# EAGLE design REF-IN-BLE-NS 4-2 Rigid (EAGLE 7.7.0)
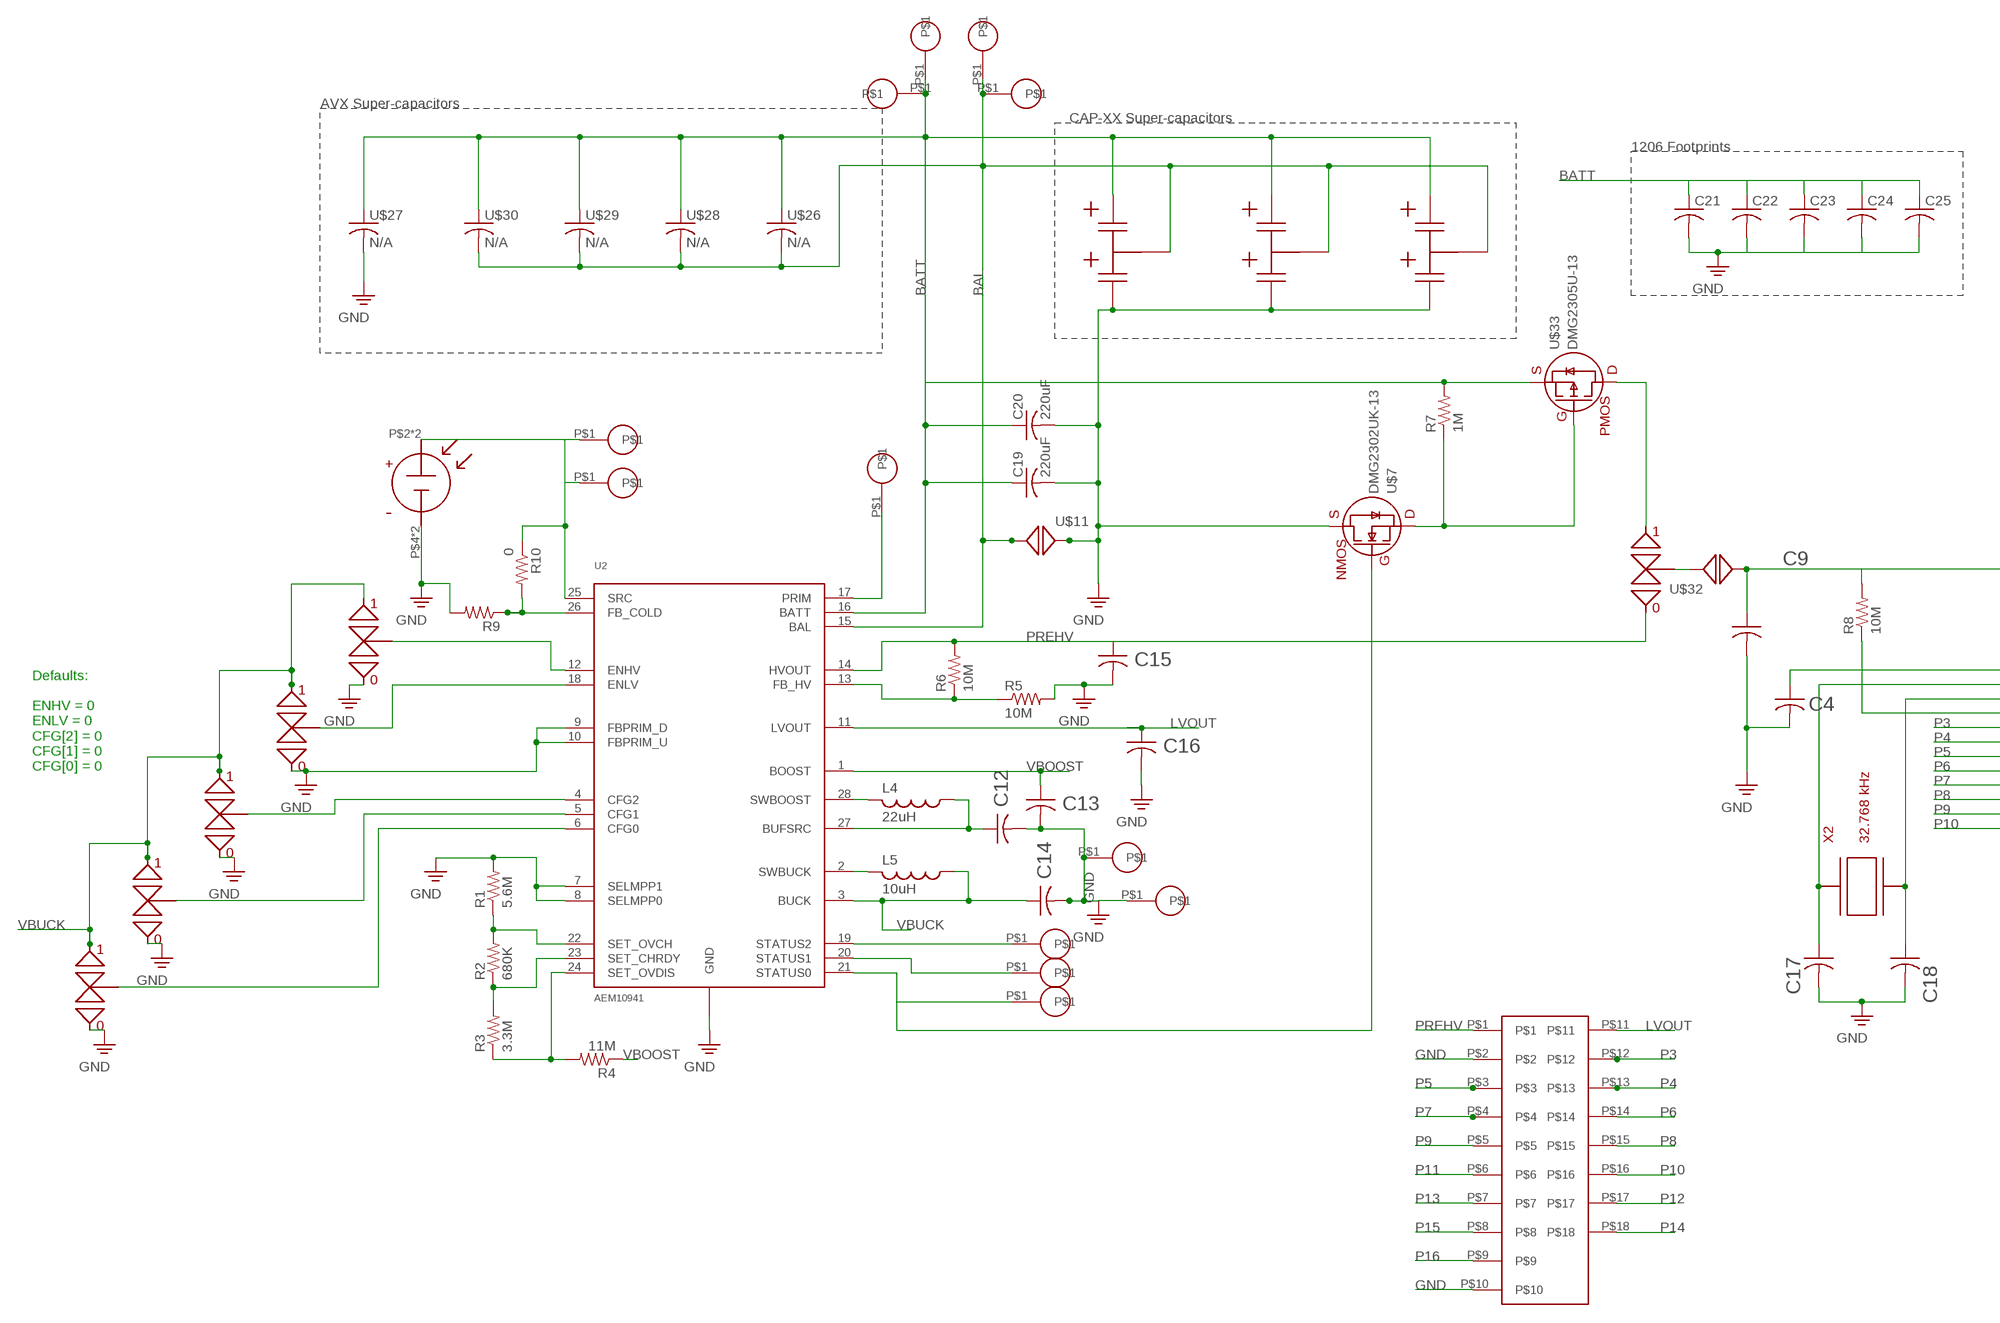
[diagram p0: schematic, sheet 1, part 1 of 2]
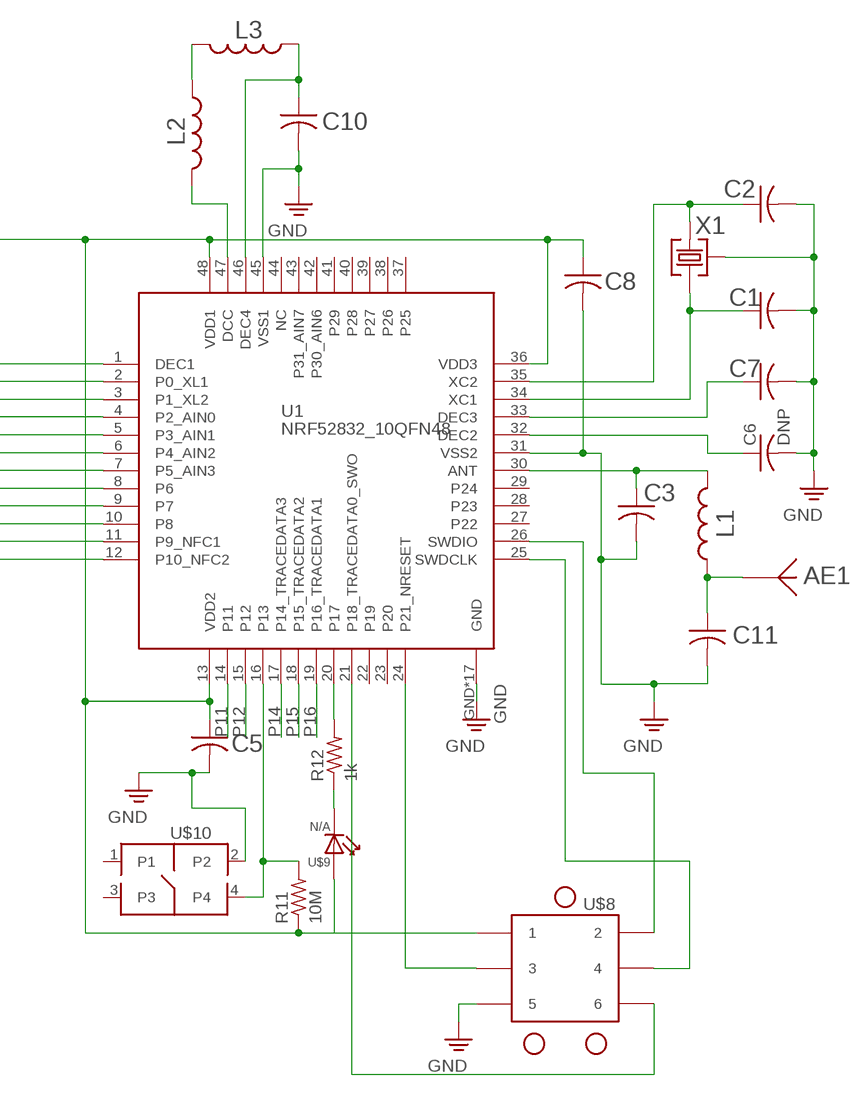
[diagram p1: schematic, sheet 1, part 2 of 2]

## Parts
AE1  2.4GHZ_ANTENNAFLIPPED  [BLE_ANTENNA_NORDIC_FLIPPED]
C1  12pF  C-UST-12PFC0603  [C0603]
C2  12pF  C-UST-12PFC0603  [C0603]
C3  0.8pF  C-UST-0.8PFC0603  [C0603]
C4  100nF  C-UST-100NFC0603  [C0603]
C5  100nF  C-UST-100NFC0603  [C0603]
C6  DNP  C-USC0603  [C0603]
C7  100pF  C-UST-100PFC0603  [C0603]
C8  100nF  C-UST-100NFC0603  [C0603]
C9  4.7uF  C-UST-4.7UFC0603  [C0603]
C10  1uF  C-UST-1UFC0603  [C0603]
C11  DNP  C-USC0603  [C0603]
C12  10uF  C-UST-10UFC0603  [C0603]
C13  22uF  C-UST-22UFC0603  [C0603]
C14  10uF  C-UST-10UFC0603  [C0603]
C15  10uF  C-UST-10UFC0603  [C0603]
C16  10uF  C-UST-10UFC0603  [C0603]
C17  12p  C-UST-12PFC0603  [C0603]
C18  12p  C-UST-12PFC0603  [C0603]
C19  220uF  C-UST-220UFC1206  [C1206]
C20  220uF  C-UST-220UFC1206  [C1206]
C21  C-USC1206  [C1206]
C22  C-USC1206  [C1206]
C23  C-USC1206  [C1206]
C24  C-USC1206  [C1206]
C25  C-USC1206  [C1206]
L1  3.9nH  L0603V-3.9NH  [L0603]
L2  10uH  L0603V-10UH  [L0603]
L3  15nH  L0603V-15NH  [L0603]
L4  22uH  L1206  [L1206]
L5  10uH  L0603V-10UH  [L0603]
R1  5.6M  R-US_R0603  [R0603]
R2  680K  R-US_R0603  [R0603]
R3  3.3M  R-US_R0603  [R0603]
R4  11M  R-US_R0603  [R0603]
R5  10M  R-US_R0603  [R0603]
R6  10M  R-US_R0603  [R0603]
R7  1M  R-US_R0603  [R0603]
R8  10M  R-US_R0603  [R0603]
R9  R-US_R0603  [R0603]
R10  0  R-US_R0603  [R0603]
R11  10M  R-US_R0603  [R0603]
R12  1k  R-US_R0603  [R0603]
U1  NRF52832_10QFN48  [NRF52832_10]
U2  AEM10941  [QFN28_5X5_05PITCH]
U$2  N/A  DOUBLE_SOLDER_BRIDGE0_CLOSED  [DOUBLE_SOLDER_BRIDGE_0_CLOSED]
U$3  N/A  DOUBLE_SOLDER_BRIDGE0_CLOSED  [DOUBLE_SOLDER_BRIDGE_0_CLOSED]
U$4  N/A  DOUBLE_SOLDER_BRIDGE0_CLOSED  [DOUBLE_SOLDER_BRIDGE_0_CLOSED]
U$5  N/A  DOUBLE_SOLDER_BRIDGE0_CLOSED  [DOUBLE_SOLDER_BRIDGE_0_CLOSED]
U$6  N/A  DOUBLE_SOLDER_BRIDGE0_CLOSED  [DOUBLE_SOLDER_BRIDGE_0_CLOSED]
U$7  DMG2302UK-13  [SOT-23-3-DIODESINC]
U$8  N/A  TC2030-IDC  [TC2030-IDC]
U$9  N/A  APT1608LZGCK  [APT1608LZGCK]
U$10  MJTP1140  [MJTP1140A]
U$11  SOLDER_BRIGDECLOSED  [SOLDER_BRIDGE_CLOSED]
U$12  N/A  1MM_PAD  [1MM_PAD]
U$13  N/A  1MM_PAD  [1MM_PAD]
U$14  N/A  1MM_PAD  [1MM_PAD]
U$15  N/A  1MM_PAD  [1MM_PAD]
U$16  SOLAR_CELL_LL200-2.4-37  [SOLAR_CELL_37X54MM]
U$17  N/A  1MM_PAD  [1MM_PAD]
U$18  N/A  1MM_PAD  [1MM_PAD]
U$19  N/A  1MM_PAD  [1MM_PAD]
U$20  18PIN_CONN  [20PIN_CONN]
U$23  N/A  CAP-XX_A-TYPE  [CAP-XX_A-TYPE]
U$24  N/A  CAP-XX_S-TYPE  [CAP-XX_S-TYPE]
U$25  N/A  CAP-XX_W-TYPE  [CAP-XX_W-TYPE]
U$26  N/A  BZ01_L-TYPE  [BZ01_L-TYPE]
U$27  N/A  BZ059_N-TYPE  [BZ059_N-TYPE]
U$28  N/A  BZ01_S-TYPE  [BZ01_S-TYPE]
U$29  N/A  BZ05_S-TYPE  [BZ05_S-TYPE]
U$30  N/A  BZ09_S-TYPE  [BZ09_S-TYPE]
U$31  DOUBLE_SOLDER_BRIDGE1_CLOSED  [DOUBLE_SOLDER_BRIDGE_1_CLOSED]
U$32  SOLDER_BRIGDECLOSED  [SOLDER_BRIDGE_CLOSED]
U$33  DMG2305U-13  [SOT-23-3-DIODESINC]
U$35  N/A  1MM_PAD  [1MM_PAD]
U$36  N/A  1MM_PAD  [1MM_PAD]
U$39  N/A  1MM_PAD  [1MM_PAD]
U$40  N/A  1MM_PAD  [1MM_PAD]
U$41  N/A  1MM_PAD  [1MM_PAD]
X1  32 MHz  FA-128-32MHZMF10Z-AJ5  [FA-128-EPSON]
X2  32.768 kHz  FC-135_32.7680KA-AC  [FC-135]

## Nets
BAL: U2.15(BAL) U$11.P$1(P1) U$19.P$1 U$23.P$1(BAL) U$24.P$1(BAL) U$25.P$1(BAL) U$26.P$3 U$26.P$4 U$28.P$3 U$29.P$3 U$30.P$3 U$41.P$1
BATT: C19.1 C20.1 C21.1 C22.1 C23.1 C24.1 C25.1 R7.2 U2.16(BATT) U$18.P$1 U$23.P$2(+) U$24.P$2(+) U$25.P$2(+) U$26.P$1 U$26.P$2 U$27.P$1 U$28.P$1 U$28.P$2 U$29.P$1 U$29.P$2 U$30.P$1 U$30.P$2 U$33.2(S) U$40.P$1
GND: C1.2 C2.2 C3.2 C4.2 C5.2 C6.2 C7.2 C8.2 C9.2 C10.2 C11.2 C12.2 C13.2 C14.2 C15.2 C16.2 C17.2 C18.2 C19.2 C20.2 C21.2 C22.2 C23.2 C24.2 C25.2 R1.2 R5.2 R9.2 U1.31(VSS2) U1.45(VSS1) U1.GND U1.P$2(GND) U1.P$3(GND) U1.P$4(GND) U1.P$5(GND) U1.P$6(GND) U1.P$7(GND) U1.P$8(GND) U1.P$9(GND) U1.P$10(GND) U1.P$11(GND) U1.P$12(GND) U1.P$13(GND) U1.P$14(GND) U1.P$15(GND) U1.P$16(GND) U1.P$17(GND) U2.7(SELMPP1) U2.8(SELMPP0) U2.9(FBPRIM_D) U2.10(FBPRIM_U) U2.GND U2.GND1(GND) U2.GND2(GND) U2.GND3(GND) U2.GND4(GND) U2.GND5(GND) U$2.IN0 U$3.IN0 U$4.IN0 U$5.IN0 U$6.IN0 U$7.2(S) U$8.P5 U$10.2 U$11.P$2(P2) U$16.P$4(GND) U$16.P$5(GND) U$17.P$1 U$20.P$2 U$20.P$10 U$23.P$3(-) U$24.P$3(-) U$25.P$3(-) U$27.P$2 U$35.P$1 X1.P2(P3) X1.P4(P3)
HVOUT: C5.1 C8.1 C9.1 R8.2 R11.1 U1.13(VDD2) U1.36(VDD3) U1.48(VDD1) U$8.P1 U$9.A U$32.P$1(P1)
LVOUT: C16.1 U2.11(LVOUT) U$20.P$11
N$1: L2.2 U1.47(DCC)
N$2: L2.1 L3.2
N$3: C10.1 L3.1 U1.46(DEC4)
N$5: C4.1 U1.1(DEC1)
N$6: C2.1 U1.35(XC2) X1.P1
N$7: C1.1 U1.34(XC1) X1.P3
N$8: C3.1 L1.2 U1.30(ANT)
N$9: AE1.P$1 C11.1 L1.1
N$10: C7.1 U1.33(DEC3)
N$11: C6.1 U1.32(DEC2)
N$12: L4.P$2 U2.28(SWBOOST)
N$13: C12.1 L4.P$1 U2.27(BUFSRC)
N$14: R1.1 R2.2 U2.22(SET_OVCH)
N$15: L5.2 U2.2(SWBUCK)
N$16: R2.1 R3.2 U2.23(SET_CHRDY)
N$17: R11.2 U1.16(P13) U$10.4
N$18: R3.1 R4.2 U2.24(SET_OVDIS)
N$19: U2.4(CFG2) U$4.OUT
N$20: U2.18(ENLV) U$3.OUT
N$21: U1.25(SWDCLK) U$8.P4
N$22: U1.24(P21_NRESET) U$8.P3
N$23: U2.12(ENHV) U$2.OUT
N$24: U1.26(SWDIO) U$8.P2
N$25: U1.21(P18_TRACEDATA0_SWO) U$8.P6
N$26: U2.5(CFG1) U$5.OUT
N$27: U2.6(CFG0) U$6.OUT
N$28: R5.1 R6.1 U2.13(FB_HV)
N$29: R10.1 U2.25(SRC) U$16.P$2(VOUT) U$16.P$3(VOUT) U$36.P$1 U$39.P$1
N$30: R12.1 U$9.C
N$31: R12.2 U1.20(P17)
N$32: R9.1 R10.2 U2.26(FB_COLD)
N$36: C17.1 U1.2(P0_XL1) X2.P$1
N$37: C18.1 U1.3(P1_XL2) X2.P$2
N$38: R8.1 U1.4(P2_AIN0)
N$45: U$31.OUT U$32.P$2(P2)
N$46: U$31.IN1 U$33.3(D)
N$47: R7.1 U$7.3(D) U$33.1(G)
P3: U1.5(P3_AIN1) U$20.P$12
P4: U1.6(P4_AIN2) U$20.P$13
P5: U1.7(P5_AIN3) U$20.P$3
P6: U1.8(P6) U$20.P$14
P7: U1.9(P7) U$20.P$4
P8: U1.10(P8) U$20.P$15
P9: U1.11(P9_NFC1) U$20.P$5
P10: U1.12(P10_NFC2) U$20.P$16
P11: U1.14(P11) U$20.P$6
P12: U1.15(P12) U$20.P$17
P13: U$20.P$7
P14: U1.17(P14_TRACEDATA3) U$20.P$18
P15: U1.18(P15_TRACEDATA2) U$20.P$8
P16: U1.19(P16_TRACEDATA1) U$20.P$9
PREHV: C15.1 R6.2 U2.14(HVOUT) U$20.P$1 U$31.IN0
PRIM: U2.17(PRIM) U$12.P$1
STATUS0: U2.21(STATUS0) U$7.1(G) U$15.P$1
STATUS1: U2.20(STATUS1) U$14.P$1
STATUS2: U2.19(STATUS2) U$13.P$1
VBOOST: C13.1 R4.1 U2.1(BOOST)
VBUCK: C14.1 L5.1 U2.3(BUCK) U$2.IN1 U$3.IN1 U$4.IN1 U$5.IN1 U$6.IN1
Unconnected: U1.22(P19) U1.23(P20) U1.27(P22) U1.28(P23) U1.29(P24) U1.37(P25) U1.38(P26) U1.39(P27) U1.40(P28) U1.41(P29) U1.42(P30_AIN6) U1.43(P31_AIN7) U1.44(NC) U$10.1 U$10.3

## Notes on the sheet
- AVX Super-capacitors
- CAP-XX Super-capacitors
- 1206 Footprints
- Defaults:
  
  ENHV = 0
  ENLV = 0
  CFG[2] = 0
  CFG[1] = 0
  CFG[0] = 0

## Library data of the parts
AE1 = 00_PF_Nordic:2.4GHZ_ANTENNA
C1 C2 = resistor:C-US: CAPACITOR, American symbol; MFG_PART#: C0603C120J5GACTU; PERCENTAGE: 5%
C3 = resistor:C-US: CAPACITOR, American symbol; MFG_PART#: CBR06C808B5GAC; PERCENTAGE: 5%
C4 C5 C8 = resistor:C-US: CAPACITOR, American symbol; MFG_PART#: CL10B104KB8NNNC; PERCENTAGE: 10%
C6 C11 C21-C25 = resistor:C-US: CAPACITOR, American symbol
C7 = resistor:C-US: CAPACITOR, American symbol; MFG_PART#: CL10C101JB8NNNC; PERCENTAGE: 5%
C9 = resistor:C-US: CAPACITOR, American symbol; MFG_PART#: CL10A475KQ8NNWC; PERCENTAGE: 5%
C10 = resistor:C-US: CAPACITOR, American symbol; MFG_PART#: CL10A105KP8NNNC; PERCENTAGE: 10%
C12 C14-C16 = resistor:C-US: CAPACITOR, American symbol; MFG_PART#: GRM188R61E106MA73D; PERCENTAGE: 20%
C13 = resistor:C-US: CAPACITOR, American symbol; MFG_PART#: GRM188R61A226ME15D; PERCENTAGE: 20%
C17 C18 = resistor:C-US: CAPACITOR, American symbol; MFG_PART#: C0603C120J5GACTU; PERCENTAGE: 5%; VALUE: 12pF
C19 C20 = resistor:C-US: CAPACITOR, American symbol; MFG_PART#: GRM31CC80G227ME11L
L1 = 00_PF_Nordic:L0603; MFG_PART#: L-14C3N9SV4T; PERCENTAGE: 5%
L2 L5 = 00_PF_Nordic:L0603; MFG_PART#: LBR2012T100M; PERCENTAGE: 20%
L3 = 00_PF_Nordic:L0603; MFG_PART#: L-14C15NJV4T; PERCENTAGE: 10%
L4 = 00_PF_Nordic:L1206
R1-R12 = resistor:R-US_: RESISTOR, American symbol
U1 = 00_PF_Nordic:NRF52832_10QFN48; MFG_PART#: NRF52832-QFAA-R
U2 = 00_PF_Nordic:AEM10941: AEM10941 ? Energy Harvesting Power Management IC; MFG_PART#: AEM10941-QFN
U$2-U$6 = 00_PF_Nordic:DOUBLE_SOLDER_BRIDGE; MFG_PART#: N/A; PERCENTAGE: N/A
U$7 = 00_PF_Nordic:DMG2302UK-13
U$8 = 00_PF_Nordic:TC2030-IDC; MFG_PART#: N/A; PERCENTAGE: N/A
U$9 = 00_PF_Nordic:APT1608LZGCK; MFG_PART#: APT1608LZGCK; PERCENTAGE: N/A
U$10 = 00_PF_Nordic:MJTP1140; MFG_PART#: TL3315NF100Q
U$11 U$32 = 00_PF_Nordic:SOLDER_BRIGDE
U$12-U$15 U$17-U$19 U$35 U$36 U$39-U$41 = 00_PF_Nordic:1MM_PAD; MFG_PART#: N/A; PERCENTAGE: N/A
U$16 = 00_PF_Nordic:SOLAR_CELL_LL200-2.4-37
U$20 = 00_PF_Nordic:18PIN_CONN
U$23 = 00_PF_Nordic:CAP-XX_A-TYPE; MFG_PART#: N/A; PERCENTAGE: N/A
U$24 = 00_PF_Nordic:CAP-XX_S-TYPE; MFG_PART#: N/A; PERCENTAGE: N/A
U$25 = 00_PF_Nordic:CAP-XX_W-TYPE; MFG_PART#: N/A; PERCENTAGE: N/A
U$26 = 00_PF_Nordic:BZ01_L-TYPE; MFG_PART#: N/A; PERCENTAGE: N/A
U$27 = 00_PF_Nordic:BZ059_N-TYPE; MFG_PART#: N/A; PERCENTAGE: N/A
U$28 = 00_PF_Nordic:BZ01_S-TYPE; MFG_PART#: N/A; PERCENTAGE: N/A
U$29 = 00_PF_Nordic:BZ05_S-TYPE; MFG_PART#: N/A; PERCENTAGE: N/A
U$30 = 00_PF_Nordic:BZ09_S-TYPE; MFG_PART#: N/A; PERCENTAGE: N/A
U$31 = 00_PF_Nordic:DOUBLE_SOLDER_BRIDGE
U$33 = 00_PF_Nordic:DMG2305U-13
X1 = 00_PF_Nordic:FA-128-32MHZMF10Z-AJ5; MFG_PART#: FA-128 32.0000MF10Z-AJ3; PERCENTAGE: 10 ppm
X2 = 00_PF_Nordic:FC-135_32.7680KA-AC; MFG_PART#: FC-135 32.7680KA-AC

## Board
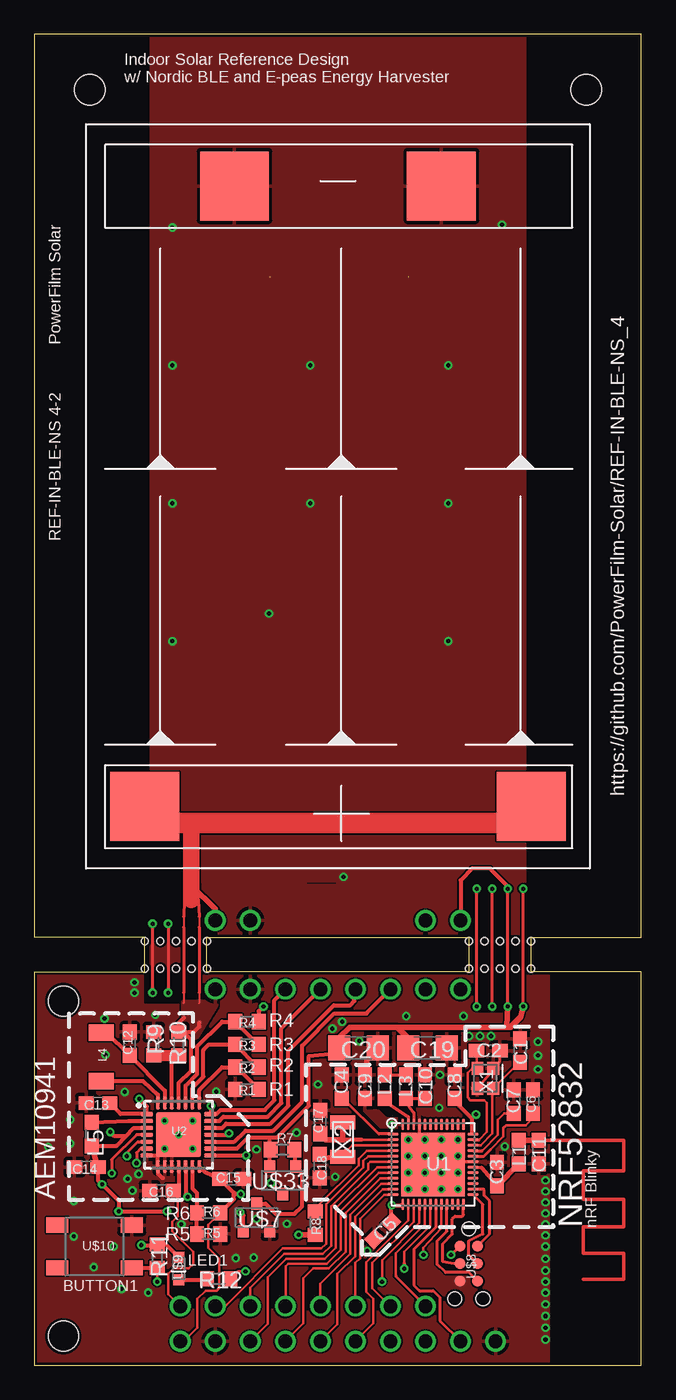
[diagram p2: board, top side]
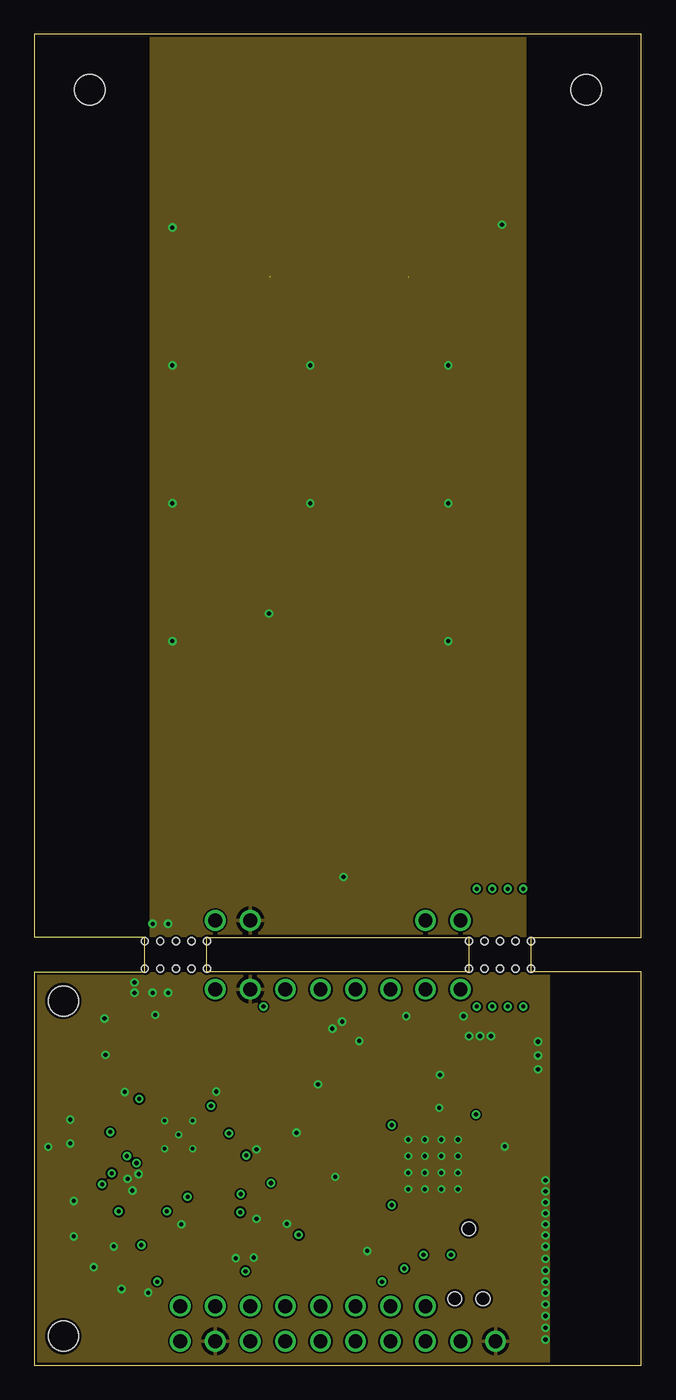
[diagram p3: board, inner layer Route2]
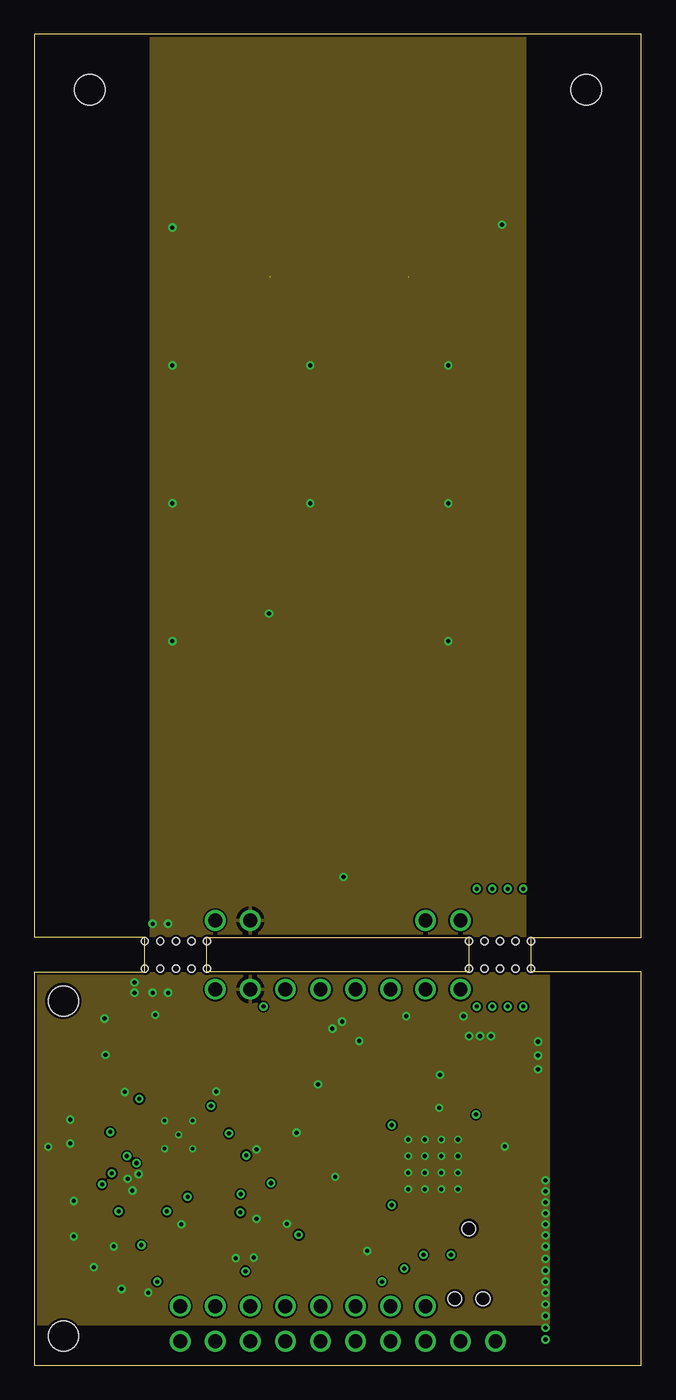
[diagram p4: board, inner layer Route15]
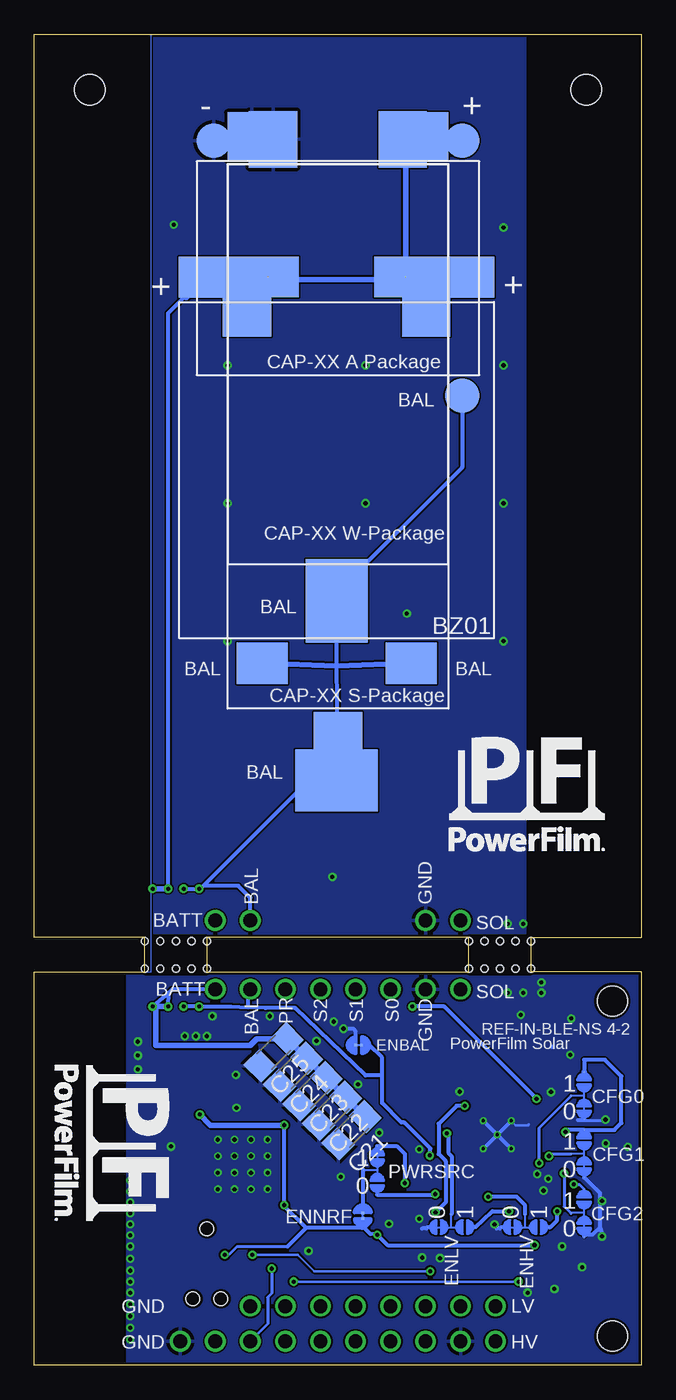
[diagram p5: board, bottom side, seen from below]

Size 44 x 96.5 mm. Coordinates in mm from the lower left corner, seen from the top.
Outline: 0,0 44,0 44,28.5 36,28.5 36,31 44,31 44,96.5 0,96.5 0,31 8,31 8,28.5 0,28.5 0,0
Outline: 12.5,31 31.5,31 31.5,28.5 12.5,28.5 12.5,31
Copper layers (1*2+15*16): Top 0.035559375mm / dielectric 1.6mm / Route2 0.0356mm / dielectric 0.1499mm / Route15 0.0356mm / dielectric 0.2007mm / Bottom 0.035559375mm
Design rules "jlcpcb2layer": minimum track width 5mil, minimum drill 0.2mm, track to track 5mil, track to pad 5mil, pad to pad 5mil, via to via 5mil, smd to smd 5mil, copper to edge 8mil, drill to drill 6mil, minimum pad ring 5mil, minimum via ring 3mil, stop-mask expansion 2.5mil, vias tented up to drill 0.3mm, thermal gap 10mil
Holes 2.2 mm at 2.1,2.1 2.1,26.4 4,92.5 40,92.5
Holes 0.5 mm at 8,30.75 9.12,30.75 10.25,30.75 11.38,30.75 12.5,30.75 8,28.75 9.12,28.75 10.25,28.75 11.38,28.75 12.5,28.75 36,30.75 34.88,30.75 33.75,30.75 32.62,30.75 31.5,30.75 31.5,28.75 32.62,28.75 33.75,28.75 34.88,28.75 36,28.75
tRestrict: area 26.5,12.2 to 26.6,16.9; area 26.6,16.9 to 27.7,17; area 28.1,16.9 to 31.2,17; area 31.2,15 to 31.4,16.9; area 26.6,12.1 to 31.2,12.2; area 8.7,16.5 to 8.8,16.9; area 10.2,18.3 to 10.7,18.4; area 12.1,16.5 to 12.2,16.9; area 10.2,15 to 10.7,15.1; area 24.8,19.9 to 28.9,20.4; area 3.6,16.5 to 4.7,17; area 4.4,18.4 to 4.8,19.6; 3 lines
bRestrict: 4 lines

### Footprints (pad centres in the part's own frame; a part is rotated, then mirrored left to right if it is on the bottom)
BLE_ANTENNA_NORDIC_FLIPPED = smd 0.254 x 0.254: P$1 0,0.13
C0603 = smd 1.1 x 1: 1 -0.85,0; 2 0.85,0
C1206 = smd 1.6 x 1.8: 1 -1.4,0; 2 1.4,0
L0603 = smd 1.1 x 1: 1 -0.85,0; 2 0.85,0
L1206 = smd 1.2 x 1.8: P$1 -1.75,0; P$2 1.75,0
R0603 = smd 1 x 1.1: 1 -0.85,0; 2 0.85,0
NRF52832_10 = smd 0.8 x 0.2: 1 -2.9,2.2; 2 -2.9,1.8; 3 -2.9,1.4; 4 -2.9,1; 5 -2.9,0.6; 6 -2.9,0.2; 7 -2.9,-0.2; 8 -2.9,-0.6; 9 -2.9,-1; 10 -2.9,-1.4; 11 -2.9,-1.8; 12 -2.9,-2.2; 25 2.9,-2.2; 26 2.9,-1.8; 27 2.9,-1.4; 28 2.9,-1; 29 2.9,-0.6; 30 2.9,-0.2; 31 2.9,0.2; 32 2.9,0.6; 33 2.9,1; 34 2.9,1.4; 35 2.9,1.8; 36 2.9,2.2 | smd 0.2 x 0.8: 13 -2.2,-2.9; 14 -1.8,-2.9; 15 -1.4,-2.9; 16 -1,-2.9; 17 -0.6,-2.9; 18 -0.2,-2.9; 19 0.2,-2.9; 20 0.6,-2.9; 21 1,-2.9; 22 1.4,-2.9; 23 1.8,-2.9; 24 2.2,-2.9; 37 2.2,2.9; 38 1.8,2.9; 39 1.4,2.9; 40 1,2.9; 41 0.6,2.9; 42 0.2,2.9; 43 -0.2,2.9; 44 -0.6,2.9; 45 -1,2.9; 46 -1.4,2.9; 47 -1.8,2.9; 48 -2.2,2.9 | smd 4.6 x 4.6: GND 0,0 | drill 0.3 pad 0.5: P$2 -0.6,-0.6; P$3 -1.8,-0.6; P$4 0.6,-0.6; P$5 1.8,-0.6; P$6 -1.8,-1.8; P$7 -0.6,-1.8; P$8 0.6,-1.8; P$9 1.8,-1.8; P$10 -1.8,0.6; P$11 -0.6,0.6; P$12 0.6,0.6; P$13 1.8,0.6; P$14 1.8,1.8; P$15 0.6,1.8; P$16 -0.6,1.8; P$17 -1.8,1.8
QFN28_5X5_05PITCH = smd 0.9 x 0.3: 1 -2.3,1.5; 2 -2.3,1; 3 -2.3,0.5; 4 -2.3,0; 5 -2.3,-0.5; 6 -2.3,-1; 7 -2.3,-1.5; 15 2.3,-1.5; 16 2.3,-1; 17 2.3,-0.5; 18 2.3,0; 19 2.3,0.5; 20 2.3,1; 21 2.3,1.5 | smd 0.3 x 0.9: 8 -1.5,-2.3; 9 -1,-2.3; 10 -0.5,-2.3; 11 0,-2.3; 12 0.5,-2.3; 13 1,-2.3; 14 1.5,-2.3; 22 1.5,2.3; 23 1,2.3; 24 0.5,2.3; 25 0,2.3; 26 -0.5,2.3; 27 -1,2.3; 28 -1.5,2.3 | smd 3.25 x 3.25: GND 0,0 | drill 0.25: GND1 0,0; GND2 1.016,1.016; GND3 1.016,-1.016; GND4 -1.016,-1.016; GND5 -1.016,1.016
DOUBLE_SOLDER_BRIDGE_0_CLOSED = smd 0.127 x 0.127: IN0 0,0.156; IN1 0,3.594; OUT -0.938,1.875
SOT-23-3-DIODESINC = smd 0.8 x 0.9: 1 -0.95,-1; 2 0.95,-1; 3 0,1
TC2030-IDC = smd 0.787 x 0.787: P1 -1.27,-0.635; P2 -1.27,0.635; P3 0,-0.635; P4 0,0.635; P5 1.27,-0.635; P6 1.27,0.635 | hole 0.991: -2.54,0; 2.54,1.016; 2.54,-1.016
APT1608LZGCK = smd 0.8 x 0.8: A 0.825,0; C -0.825,0
MJTP1140A = smd 1.6 x 1.1: 1 -2.7,1.55; 2 2.7,1.55; 3 -2.7,-1.55; 4 2.7,-1.55
SOLDER_BRIDGE_CLOSED = smd 0.203 x 0.203: P$1 -0.203,0; P$2 0.203,0
1MM_PAD = drill 1: P$1 0,0
SOLAR_CELL_37X54MM = smd 5 x 5: P$2 -22.5,-14; P$3 -22.5,14; P$4 22.5,7.5; P$5 22.5,-7.5
20PIN_CONN = drill 1 pad 1.5: P$1 -11.43,-1.27; P$2 -8.89,-1.27; P$3 -6.35,-1.27; P$4 -3.81,-1.27; P$5 -1.27,-1.27; P$6 1.27,-1.27; P$7 3.81,-1.27; P$8 6.35,-1.27; P$9 8.89,-1.27; P$10 11.43,-1.27; P$11 -11.43,1.27; P$12 -8.89,1.27; P$13 -6.35,1.27; P$14 -3.81,1.27; P$15 -1.27,1.27; P$16 1.27,1.27; P$17 3.81,1.27; P$18 6.35,1.27
CAP-XX_A-TYPE = smd 2.5 x 2.5: P$1 0,0; P$2 18.5,0; P$3 18.5,18
CAP-XX_S-TYPE = smd 3.5 x 3.5: P$1 0,0; P$2 43.5,-6.25; P$3 43.5,6.25
CAP-XX_W-TYPE = smd 3.5 x 3.5: P$1 0,0; P$2 33,-6.25; P$3 33,6.25
BZ01_L-TYPE = smd 3 x 3.7: P$1 0,0; P$2 0,19.2; P$3 28,15; P$4 28,4.2
BZ059_N-TYPE = smd 4.1 x 3.5: P$1 0,0; P$2 0,9.4
BZ01_S-TYPE = smd 5.8 x 3.5: P$1 0,0; P$2 0,13 | smd 4.5 x 6: P$3 35.1,6.5
BZ05_S-TYPE = smd 2.9 x 4.5: P$1 0,0; P$2 0,10 | smd 3 x 4.5: P$3 25,5
BZ09_S-TYPE = smd 2.9 x 4.5: P$1 0,0; P$2 0,10 | smd 3 x 4.5: P$3 22,5
DOUBLE_SOLDER_BRIDGE_1_CLOSED = smd 0.127 x 0.127: IN0 0.05,0.106; IN1 0.05,3.644; OUT -0.938,1.875
FA-128-EPSON = smd 0.95 x 0.85: P1 -0.725,-0.575; P2 0.725,-0.575; P3 0.725,0.575; P4 -0.725,0.575
FC-135 = smd 1 x 1.8: P$1 0,0; P$2 2.5,0

### Placement (x,y rotation side)
AE1  37.38,16.3 270 top
C1  35.2,22.81 90 top
C2  32.9,22.8 0 top
C3  33.54,13.85 90 top
C4  22.27,20.19 90 top
C5  25.25,9.75 225 top
C6  36.14,19.1 90 top
C7  34.75,19.1 90 top
C8  30.47,20.19 90 top
C9  23.96,20.19 90 top
C10  28.31,20.19 90 top
C11  36.56,15.45 270 top
C12  6.9,23.3 90 top
C13  4.6,19 180 top
C14  3.75,14.35 180 top
C15  14.3,13.5 0 top
C16  9.2,12.65 180 top
C17  20.71,17.63 90 top
C18  20.69,14.42 270 top
C19  28.5,23 0 top
C20  23.5,23 0 top
C21  21,17.02 225 bottom
C22  22.41,18.44 225 bottom
C23  23.83,19.85 225 bottom
C24  25.24,21.27 225 bottom
C25  26.66,22.68 225 bottom
L1  35.11,15.45 270 top
L2  25.39,20.19 270 top
L3  26.93,20.19 90 top
L4  4.85,22.35 270 top
L5  4.15,16.75 90 top
R1  15.4,20 180 top
R2  15.4,21.6 180 top
R3  15.4,23.25 180 top
R4  15.4,24.9 180 top
R5  12.62,9.5 0 top
R6  12.62,11.05 0 top
R7  17.98,15.62 180 top
R8  20.35,10.3 270 top
R9  8.65,23.3 90 top
R10  10.45,23.3 270 top
R11  8.9,7.9 270 top
R12  13.36,6.25 0 top
U1  28.9,14.55 0 top
U2  10.45,16.7 0 top
U$2  10.3,10 270 bottom
U$3  15.65,10 270 bottom
U$4  4.15,9.15 0 bottom
U$5  4.15,13.45 0 bottom
U$6  4.15,17.65 0 bottom
U$7  16.1,10.7 0 top
U$8  31.5,7.35 270 top
U$9  10.45,7 90 top
U$10  4.35,8.6 0 top
U$11  20.5,23.2 180 bottom
U$12  25.81,27.25 0 top
U$13  23.27,27.25 0 top
U$14  20.73,27.25 0 top
U$15  18.19,27.25 0 top
U$16  22,63 90 top
U$17  15.65,32.25 0 top
U$18  30.89,27.25 0 top
U$19  28.35,27.25 0 top
U$20  22,3 0 top
U$23  13,70.3 90 bottom
U$24  22,45.6 90 bottom
U$25  22,56.1 90 bottom
U$26  31.7,78.9 270 bottom
U$27  17.3,88.9 90 bottom
U$28  28.6,77.5 270 bottom
U$29  27.1,78.9 270 bottom
U$30  27.1,78.95 270 bottom
U$31  19.2,12.25 0 bottom
U$32  20.2,10.82 90 bottom
U$33  18,13.4 180 top
U$35  15.65,27.25 0 top
U$36  13.11,27.25 0 top
U$39  13.11,32.25 0 top
U$40  30.89,32.25 0 top
U$41  28.35,32.25 0 top
X1  32.69,20.8 270 top
X2  22.36,17.6 270 top

### Tracks (layer width: path | path; a pad name or v marks a point on that pad's centre or on a via)
BAL  (via drill 0.3 pad 0.6)
  Top 0.2: v32.06,26 v32.06,34.54 | v33.19,26 v33.19,34.54
  Top 0.3: U2.15 v15.35,15.2
  Bottom 0.254: 19.7,23.2 U$11.P$1
  Bottom 0.3: v15.35,15.2 15.3,15.25 15.3,15.7 17.2,17.6 17.4,17.6 18.8,19 18.8,21 | 18.8,21 18.8,22.3 19.7,23.2 | U$24.P$1 22.1,50.7 U$29.P$3 | U$23.P$1 13,65.1 U$25.P$1 | v33.19,26 v32.06,26 29.75,26 28.5,25.95 | v33.19,34.54 v32.06,34.54 32.06,34.44 31.75,34.75 | 18.8,21 20,21 25.1,25.9 27.25,25.9 28.5,25.95 | 28.5,25.95 28.5,27.1 U$19.P$1 | 31.75,34.75 24.1,42.4 U$28.P$3 | U$41.P$1 28.35,33.89 29.21,34.75 31.75,34.75
  Bottom 0.406: U$26.P$3 22.1,50.7 U$26.P$4 | U$30.P$3 U$25.P$1 U$29.P$3 | U$24.P$1 22.1,43.2 22.3,43 22.3,42.5 U$28.P$3
BATT  (via drill 0.3 pad 0.6)  (2 unrouted)
  Top 0.2: v34.31,26 v34.31,34.54 | v35.44,26 v35.44,34.54
  Top 0.3: U2.16 14.7,15.7 15.5,16.5 17.15,16.5 17.6,16.5 19.9,18.8 19.9,22.4 21.75,22.55 | 22.9,24.5 22.85,24.5 | C19.1 27,23 | v34.31,34.54 34.31,34.73 33.02,36.02 31.75,36.02 30.89,35.16 U$40.P$1
  Top 0.305: U$33.2 17.05,15.65 | 17.05,15.65 17.05,16.4 17.15,16.5 | R7.2 17.07,15.62 17.05,15.65
  Top 0.4: 21.75,22.55 21.75,22.65 C20.1 22.1,23.75 22.85,24.5 | 27,23 27,23.8 26.3,24.5 | 26.3,24.5 22.9,24.5 | 26.3,24.5 34.5,24.5 35.25,25.25 v35.44,26 | v34.31,26 34.25,24.6
  Bottom 0.3: U$25.P$2 15.3,89.1 13.5,89.1 U$23.P$2 | U$18.P$1 34,27.25 34.25,27 | 34.25,27 v35.44,26 | v34.31,26 34.25,27 | v34.31,34.54 34.31,76.29 U$26.P$1
  Bottom 0.4: v35.44,26 35.2,26 v34.31,26 | v34.31,34.54 v35.44,34.54 | 33,77.4 U$26.P$1 | U$30.P$2 17.1,88.7 U$27.P$1
  Bottom 0.406: U$26.P$2 16.6,78.7 | 16.6,78.7 28.4,78.7 | 28.4,78.7 U$26.P$1 | U$27.P$1 15.5,88.9 15.3,89.1 | U$30.P$2 16.8,78.9 16.6,78.7 | 16.6,78.7 16.6,78.4 U$28.P$2 | U$28.P$1 28.3,77.8 28.3,78.6 | 28.3,78.6 28.4,78.7 | 28.3,78.6 27.4,78.6 U$30.P$1 | C21.1 C22.1 C23.1 C24.1 C25.1 27.9,23.65 28.35,23.2 35.2,23.2 35.2,26
GND  (via drill 0.3 pad 0.6)
  Top 0.195: X1.P2 33.27,21.43 X1.P4 33.75,22.01 C2.2
  Top 0.2: U1.45 27.9,16.75 | U1.31 31.1,14.75 | v9.69,32 v9.69,27 | v8.56,27 v8.56,32
  Top 0.3: 8.95,15.2 U2.8 8.95,13.9 9.3,13.55 | 8.95,15.2 U2.GND4 | U2.7 8.95,15.2 | 27.9,16.75 U1.P$16 | 3.5,19.25 C13.2 | C9.2 24.07,21.02
  Top 0.406: 24.07,21.02 24.07,22.18 24.62,22.73
  Bottom 0.195: 8.15,17.45 8.2,17.4 9.12,17.4 U2.GND5
  Bottom 0.2: v2.6,17.8 2.65,17.75 4.1,17.75 U$6.IN0 | 6.45,23.1 6.46,23.1
  Bottom 0.3: 3,10 3.54,9.46 4.15,9.46 U$4.IN0 | 3,10 3,12.46 U$5.IN0 | U2.GND5 U2.GND | U2.GND2 U2.GND | U2.GND U2.GND3 | U2.GND4 U2.GND | 6.45,23.1 6.45,23.05 | 3,10 3,9.95 v2.85,9.32 | v21.6,24.4 20.9,24.4 20.75,24.25 20.75,23.25 U$11.P$2 | U$2.IN0 10.24,9.9 10.5,9.9 | U$3.IN0 15.59,9.9 15.9,9.9
  Bottom 0.305: 4.1,17.75 4.6,17.75
  Bottom 0.406: U$25.P$3 26.9,89.1 U$27.P$2
  other vias: 5.15,22.5 8.75,25.4 17,54.5 30,52.5 10,52.5 10,62.5 20,62.5 30,62.5 30,72.5 20,72.5 10,72.5 10,82.5 33.9,82.7 8.25,5.25 4.3,7.1 21.8,13.65 5.08,25.13 2.59,16.07 10.65,10.21 6.3,5.52 22.4,35.4 5.75,8.6 20.55,20.35 24.12,8.28 37.05,9.4 18.3,10.25 7.1,12.65 7.55,13.85 2.85,11.9 6.75,13.5 14.6,7.75 7.25,27.75 7.25,27 22.3,24.9 26.95,25.3 31.1,25.3 37.05,11 29.35,18.65 16.1,10.6 16.1,15.65 23.55,23.5 29.4,21.05 34.1,15.85 36.5,21.45 36.5,22.45 36.5,23.45 31.5,23.85 32.3,23.85 33.1,23.85 19,16.85 0.99,15.82 13.18,19.83 6.55,19.8 15.9,7.8 37.05,10.2 37.05,6.85 37.05,6.05 37.05,5.25 37.05,4.4 37.05,3.55 37.05,2.7 37.05,1.85 37.05,11.8 37.05,13.4 37.05,12.6 37.05,8.6 37.05,7.7
  pour Bottom (rank 3): 0,0 37.25,0 37.25,28.5 35.55,28.5 35.55,96.5 8.45,96.5 8.45,28.5 0,28.5
  pour Bottom: 0,0 37.25,0 37.25,28.5 35.55,28.5 35.55,96.5 8.45,96.5 8.45,28.5 0,28.5
  pour Top (rank 2): 0,0 37.25,0 37.25,28.5 35.55,28.5 35.55,96.5 8.5,96.4 8.5,28.5 0,28.5
  pour Top (rank 2): 0,0 37.25,0 37.25,28.5 35.55,28.5 35.55,96.5 8.45,96.5 8.45,28.5 0,28.5
  pour Route15: 35.55,96.5 35.55,28.4 37.25,28.4 37.25,3 0,3 0,28.5 8.45,28.5 8.45,96.5
  pour Route2: 35.55,96.5 35.55,28.4 37.25,28.4 37.25,0 0,0 0,28.5 8.45,28.5 8.45,96.5
HVOUT  (via drill 0.3 pad 0.6)
  Top 0.127: C8.1 30.6,19.25 30.53,19.21
  Top 0.195: 20.3,9.45 R8.2 | 8.9,8.7 R11.1
  Top 0.2: 26.6,11.6 U1.13 | 31.7,16.8 U1.36 | C9.1 24.05,19.33 24.05,19.26 24.07,19.28 | U$8.P1 30.82,8.62 v30.2,8
  Top 0.3: 31.7,17.9 31.7,16.8 | 26.6,11.6 v25.9,11.6 25.85,11.55 C5.1 | R11.1 9.53,8.75 U$9.A | v7.75,8.7 8.9,8.7
  Top 0.305: v32.01,18.17 31.92,18.12 31.7,17.9 30.47,19.13 C8.1
  Top 0.406: C8.1 30.49,19.11 | 20.3,9.45 v19.15,9.45
  Bottom 0.195: 20.2,10.65 U$32.P$1 20.2,10.05 20.25,10 20.25,9.95 | v25.91,11.6 25.95,11.6 | 25.95,11.6
  Bottom 0.2: v30.2,8 29.9,8 29.3,8.6 25.65,8.6
  Bottom 0.3: 25.91,11.56 v25.91,11.6 25.9,16.6 | 25.95,11.55 v25.9,11.6 | 20.2,10.05 19.65,9.5 v19.15,9.45 18.4,8.7 v7.75,8.7 | 20.25,9.95 24.3,9.95 | 24.3,9.95 25.95,11.6 | 24.3,9.95 25.65,8.6
  Bottom 0.305: 25.9,16.6 v25.9,17.4 | 20.15,10.6 20.2,10.65
  Bottom 0.406: v32.01,18.17 31.24,17.4 v25.9,17.4 | 25.9,11.5 v25.9,11.6 v25.91,11.6 | v25.91,11.6
  pour Top (isolate 0.254): 23.55,19.9 23.55,18.55 25.05,17.05 26.8,17.05 26.8,17.85 25.5,17.85 24.55,18.8 24.55,19.9
LVOUT
  Top 0.195: U$20.P$11 9.7,5.14 9.7,6.6 10.1,7 11.2,7 11.5,7.3 11.5,8.2 10,9.7 10,10.4 10.4,10.8 10.4,12.2 10.05,12.55 C16.1
  Top 0.3: U2.11 10.45,12.95 10.15,12.65 C16.1
N$1
  Top 0.127: 27.1,17.5 U1.47
  Top 0.2: L2.2 25.39,19.11 27.1,18 27.1,17.5
N$2
  Top 0.2: L2.1 L3.2
N$3
  Top 0.2: U1.46 27.5,18.3 27.03,18.93 L3.1 C10.1
N$5
  Top 0.2: 22.34,19.22 C4.1 | U1.1 24.96,16.75 22.54,19.17
  Top 0.3: 22.54,19.17 22.54,19.62 C4.1
N$6
  Top 0.195: U1.35 32.25,16.35 32.8,16.9 32.8,19 32.6,19.2 31.6,19.2 31.4,19.4 31.4,21.2 31.73,21.52 X1.P1 32.05,21.59 C2.1
  Top 0.2: U1.35 32.24,16.35
N$7
  Top 0.195: U1.34 32.35,15.95 33.2,16.8 33.2,20.01 X1.P3 35.15,21.96 C1.1
N$8
  Top 0.2: U1.30 32.4,14.35 32.44,14.3
  Top 0.3: 32.44,14.3 C3.1
  Top 0.406: C3.1 L1.2
N$9
  Top 0.25: C11.1 AE1.P$1
  Top 0.406: L1.1 C11.1
N$10
  Top 0.195: 34.75,17.85 C7.1 34.05,18.25 33.6,17.8 33.6,16.7 32.45,15.55
  Top 0.2: U1.33 32.45,15.55
N$11
  Top 0.195: C6.1 36.14,17.94 35.6,17.4 34.2,17.4 34,17.2 34,16.57 33.07,15.64
  Top 0.2: U1.32 32.58,15.15 33.07,15.64
N$12
  Top 0.3: L4.P$2 7.85,20.6 8.95,19.6 U2.28
N$13
  Top 0.3: U2.27 9.45,19.9 C12.1 5.17,24.18 L4.P$1
N$14
  Top 0.3: U2.22 11.95,19.95 13.6,21.6 R2.2
  Top 0.305: R2.2 14.65,21.6 R1.1
N$15
  Top 0.3: L5.2 6.8,17.7 U2.2
N$16
  Top 0.3: U2.23 11.45,20.1 12.25,20.9 12.25,22.85 12.65,23.25 R3.2
  Top 0.305: R2.1 16.2,21.6 R3.2
N$17  (via drill 0.3 pad 0.6)
  Top 0.195: 27.9,11.2 27.9,10.3 25.2,7.6 v25.2,6.05 | v8.9,6.05 R11.2
  Top 0.2: U1.16 27.9,11.2
  Top 0.3: U$10.4 R11.2
  Bottom 0.195: v25.2,6.05 v8.9,6.05
N$18
  Top 0.195: 14.5,24.9 R4.2
  Top 0.3: 14.35,24.65 14.45,24.65 R4.2 13.6,24.9 11.8,23.1 11.8,21.1 10.95,20.25 U2.24
  Top 0.305: R3.1 16.2,23.25 R4.2
N$19  (via drill 0.3 pad 0.6)
  Top 0.2: U2.4 7.4,16.7 5.6,14.9 v5.6,13.9
  Bottom 0.195: 5.1,11 5.09,11.01 U$4.OUT
  Bottom 0.2: v5.6,13.9 5.6,11.5 5.1,11
N$20  (via drill 0.3 pad 0.6)
  Top 0.3: U2.18 14,16.7 v14.1,16.8
  Bottom 0.3: v14.1,16.8 14,16.7 14,15.4 13.75,15.15 13.75,10.96 U$3.OUT
N$21
  Top 0.18: 31.5,9 32.5,9.5
  Top 0.2: U$8.P4 31.5,7.99 31.5,9 | 32.5,9.5 32.5,11.65 U1.25
N$22
  Top 0.2: U$8.P3 30.45,7.35 29.6,7.5 29.6,8.8 30.3,9.5 30.3,10.6 30.5,10.8 31,10.8 31.1,10.9 U1.24
N$23  (via drill 0.3 pad 0.6)
  Top 0.3: U2.12 10.95,12.35 v11.1,12.2
  Bottom 0.3: U$2.OUT 8.43,11.57 9.05,12.2 v11.1,12.2
N$24
  Top 0.2: U$8.P2 32.13,8.63 33,9.5 33,11.9 32.6,12.3 32.6,12.7 32.55,12.75 U1.26
N$25
  Top 0.2: U$8.P6 31.5,6.72 29.8,6.72 29.2,7.3 29.2,9 29.9,9.7 U1.21
N$26  (via drill 0.3 pad 0.6)
  Top 0.2: U2.5 7.5,16.2 6.7,15.4 v6.7,15.15
  Bottom 0.195: 5.1,15.3 U$5.OUT
  Bottom 0.2: v6.7,15.15 6.6,15.15 6.45,15.3 5.1,15.3
N$27  (via drill 0.3 pad 0.6)
  Top 0.2: U2.6 7.7,15.7 7.4,15.4 v7.4,14.65
  Bottom 0.2: U$6.OUT 7.4,17.21 v7.4,14.65
N$28
  Top 0.3: U2.13 11.45,12.8 11.78,12.47 R6.1
  Top 0.305: R5.1 R6.1
N$29
  Top 0.15: 10.81,32.5 10.81,31.75 | 11.94,32.5 11.94,31.75 | 10.81,27 10.81,26.25 | 11.94,27 11.94,26.25
  Top 0.2: 10.81,32.5 10.88,33.75 11.38,33.75 11.88,33.75 11.94,32.5 | 10.81,31.75 10.81,27 | 11.94,31.75 11.94,27
  Top 0.3: U2.25 10.45,20.45 11.35,21.35 11.35,23.6 10.8,24.15 | 10.8,24.15 R10.1 | 10.8,24.15 11.55,24.15 11.95,24.55 11.95,24.85 | 10.45,24.25 10.45,24.8 10.85,25.2
  Top 0.4: U$39.P$1 13.11,33.06 11.38,34.8
  Top 0.406: 36,39.3 U$16.P$2 | U$16.P$3 8,39.3
  Top 1.2: 11.38,33.75 11.38,34.8 11.38,39.3
  Top 1.5: 8,39.3 11.38,39.3 36,39.3
  pour Top: 10.75,26.4 12.95,26.4 12.95,27.1 13.2,27.1 13.2,26.1 11.75,23.7 10.75,23.7
N$30
  Top 0.3: U$9.C 12.07,6.17 R12.1
N$31  (via drill 0.3 pad 0.6)
  Top 0.195: U1.20 29.5,9.9 28.2,8.5 v28.2,8 | v15.3,6.8 14.76,6.8 R12.2
  Bottom 0.195: v28.2,8 24.9,8 23.7,6.8 v15.3,6.8
N$32
  Top 0.127: 10.15,22.15 10.25,22.25 R9.1
  Top 0.3: U2.26 9.95,21.95 10.15,22.15
  Top 0.813: R9.1 R10.2
N$33
  cutout Route2: 8,28.5 12.5,28.5 12.5,31 8,31
  cutout Route2: 31.5,28.5 36,28.5 36,31 31.5,31
N$35
  cutout Route15: 8,31 12.5,31 12.5,28.5 8,28.5
N$36
  Top 0.195: U1.2 23.7,16.35
  Top 0.3: 23.7,16.35 22.4,16.35
  Top 0.406: C17.1 21.13,16.35 22.4,16.35 22.36,16.34 X2.P$1
N$37
  Top 0.195: U1.3 23.05,15.95 22.65,15.55
  Top 0.406: 22.65,15.55 22.5,15.4 22.35,15.14 X2.P$2 20.72,15 C18.1
N$38
  Top 0.195: 20.55,11.55 23.5,14.5 23.5,14.95 24.1,15.55 U1.4
  Top 0.25: R8.1 20.55,11.55
N$39
  cutout Route15: 31.5,31 36,31 36,28.5 31.5,28.5
N$40
  Bottom 0: 37.25,28.5 35.55,28.5 35.55,96.5
N$45
  Bottom 0.305: U$31.OUT 20.2,14.05 U$32.P$2 19.95,11.28
N$46  (via drill 0.3 pad 0.6)
  Top 0.305: v17.15,13.2 17.9,12.45 18,12.45 U$33.3
  Bottom 0.305: U$31.IN1 17.74,15.89 17.15,15.3 v17.15,13.2
N$47
  Top 0.305: R7.1 18.88,14.47 U$33.1 19.4,13.95 19.4,11.5 18.85,10.95 17.5,10.95 16.75,11.7 U$7.3
N$48
  cutout Top: 8,28.5 8,26.25 10.5,26.25 10.5,28.5
N$49
  cutout Top: 8,30.75 10.5,30.75 10.5,32.75 8,32.75
P3
  Top 0.195: U1.5 24.2,15.15 23.85,14.8 23.85,14.35 21.15,11.65 21.15,8.8 20.8,8.45 18,8.45 13.82,4.27 U$20.P$12
P4
  Top 0.195: U1.6 24.35,14.75 24.2,14.6 24.2,14.2 21.5,11.5 21.5,8.65 20.9,8.05 18.1,8.05 15.65,5.6 U$20.P$13
P5
  Top 0.195: U1.7 24.85,14.35 21.85,11.35 21.85,8.5 21.05,7.7 18.25,7.7 16.9,6.35 16.9,2.98 U$20.P$3
P6
  Top 0.195: U1.8 24.95,13.95 22.2,11.2 22.2,8.35 21.2,7.35 18.4,7.35 18.2,7.15 U$20.P$14
P7
  Top 0.195: U1.9 25.05,13.55 22.55,11.05 22.55,8.2 21.35,7 20.2,7 19.5,6.3 19.5,3.04 U$20.P$4
P8
  Top 0.195: U1.10 25.15,13.15 22.9,10.9 22.9,8.05 20.73,5.88 U$20.P$15
P9
  Top 0.195: U1.11 25.25,12.75 23.25,10.75 23.25,7.9 21.95,6.6 21.95,2.95 U$20.P$5
P10
  Top 0.195: U1.12 25.35,12.35 23.6,10.6 23.6,7.75 23.25,7.4 23.25,4.29 U$20.P$16
P11
  Top 0.195: U1.14 27.1,10.5 24.05,7.45 24.05,5.3 24.55,4.8 24.55,3.01 U$20.P$6
P12
  Top 0.195: U1.15 27.5,10.4 24.5,7.4 24.5,5.58 U$20.P$17
P14
  Top 0.195: U1.17 28.3,10.2 26.2,8.1 26.2,6.5
  Top 0.2: 26.2,6.5 26.2,6.42 U$20.P$18
  Bottom 0.195: 28.3,4.32 U$20.P$18
P15  (via drill 0.3 pad 0.6)
  Top 0.195: U1.18 28.7,10.1 26.8,8.2 26.8,7.4
  Top 0.2: 26.8,7.4 v26.8,7
  Bottom 0.2: v26.8,7 26.8,5.2 27.1,4.9 27.1,2.98 U$20.P$8
P16
  Top 0.2: U1.19 29.1,10 27.5,8.4 27.5,5.8 27.9,5.4 28.9,5.4 29.4,4.9 29.4,3.22 U$20.P$9
PREHV  (via drill 0.3 pad 0.6)
  Top 0.195: R6.2 12.6,10.18 12.6,8.5 13.4,7.7 13.4,5.6 13.2,5.4 12.4,5.4 11.8,4.8 11.8,2.7 10.83,1.73 U$20.P$1
  Top 0.3: U2.14 12.35,14 C15.1 14.45,12.5 14.45,12.4 | 14.45,12.4 v14.95,12.4 | R6.2 14.45,12.03 14.45,12.4
  Bottom 0.305: v14.95,12.4 14.96,12.38 14.99,12.36 U$31.IN0
PRIM
  Top 0.3: U2.17 14.5,16.2 15.3,17 17.3,17 19.4,19.1 19.4,23.15 21.75,25.5 24.06,25.5 U$12.P$1
STATUS0  (via drill 0.3 pad 0.6)
  Top 0.195: U$7.1 15.18,9.68 15.22,9.68
  Top 0.3: 12.7,18.2 U2.21 13.2,18.2 13.5,18.5 16.7,18.5 17.4,19.2 17.4,26.46 U$15.P$1 | U$7.1 15.15,10.85 v14.93,11.07
  Top 0.305: v12.8,18.8 12.8,18.25 U2.21
  Bottom 0.3: v12.8,18.8 13.4,18.8 14.7,17.5 14.7,15.3 14.2,14.8 14.2,11.8 v14.93,11.07
STATUS1
  Top 0.3: U2.20 13.4,17.7 13.7,18 16.9,18 17.9,19 17.9,24.42 U$14.P$1
STATUS2
  Top 0.3: U2.19 13.6,17.2 13.9,17.5 17.1,17.5 18.4,18.8 18.4,22.8 21.7,26.1 22.9,26.1 23.2,26.4 23.2,27.18 U$13.P$1
VBOOST  (via drill 0.3 pad 0.6)
  Top 0.127: R4.1 16.5,24.85 16.5,24.9
  Top 0.3: 16.4,25 16.5,24.9 16.4,24.9 | C13.1 6.25,18.2 U2.1 8.15,18.75 v7.6,19.3 | v16.6,26 16.25,25.65 R4.1
  Bottom 0.3: v7.6,19.3 14.3,26 v16.6,26
VBUCK  (via drill 0.3 pad 0.6)
  Top 0.3: L5.1 5.95,15.9 6.6,16.6 | U2.3 7.2,17.2 6.6,16.6 | 6.6,16.6 5.8,16.6 v5.5,16.9 | v4.9,13.1 6.1,11.9 v6.1,11.15 v9.6,11.15
  Top 0.305: C14.1 4.6,13.4 v4.9,13.1
  Top 0.406: L5.1 C14.1
  Bottom 0.195: U$4.IN1
  Bottom 0.2: v4.9,13.1 4.5,13.1 U$4.IN1
  Bottom 0.3: v5.5,16.9 5.36,17.04 U$5.IN1 1.96,17.04 1.45,17.55 1.45,20.95 2.64,22.14 4.15,22.14 U$6.IN1 | U$2.IN1 6.6,10 6.1,10.5 v6.1,11.15 | U$3.IN1 10.81,11.15 v9.6,11.15
  Bottom 0.406: U$6.IN1 4.15,21.1

### Text on the board
tPlace: Indoor Solar Reference Design / w/ Nordic BLE and E-peas Energy Harvester | PowerFilm Solar | REF-IN-BLE-NS 4-2 | https://github.com/PowerFilm-Solar/REF-IN-BLE-NS_4 | R4 | R3 | R2 | R1 | AEM10941 | R6 | NRF52832 | nRF Blinky | R5 | LED1 | BUTTON1
bPlace: + | - | + | + | BAL | BAL | BAL | BAL | BAL | GND | BAL | BATT | SOL | BATT | SOL | GND | S0 | S1 | S2 | PR | BAL | REF-IN-BLE-NS 4-2 | PowerFilm Solar | ENBAL | CFG0 | CFG1 | PWRSRC | CFG2 | ENNRF | ENHV | ENLV | GND | LV | GND | HV
tNames: U1